# EAGLE design untitled (EAGLE 5.09)
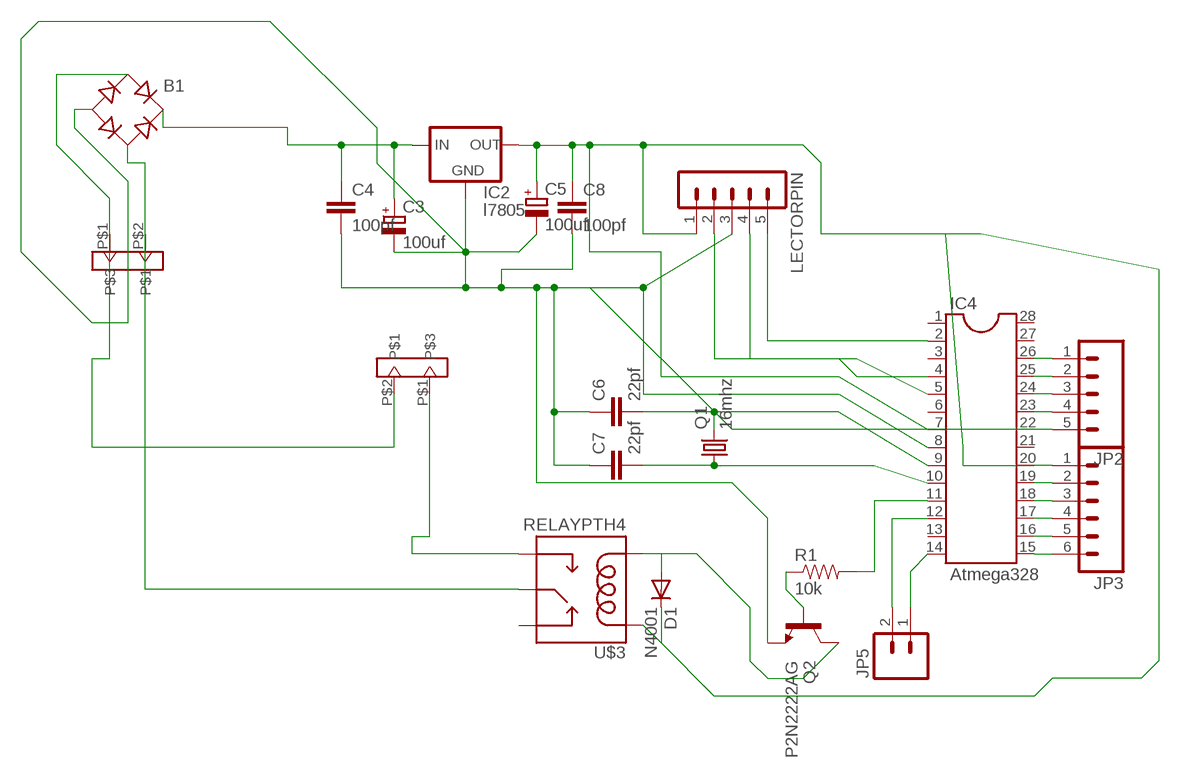
[diagram p0: schematic, sheet 1]

## Parts
B1  RB1A  [RB1A]
C3  100uf  CPOL-EUE5-4  [E5-4]
C4  100pf  C-EU025-025X050  [C025-025X050]
C5  100uf  CPOL-EUE5-4  [E5-4]
C6  22pf  C-EU025-025X050  [C025-025X050]
C7  22pf  C-EU025-025X050  [C025-025X050]
C8  100pf  C-EU025-025X050  [C025-025X050]
D1  N4001  DIODEPTH  [DIODE-1N4001]
IC2  l7805  V_REG_78XXSIDE  [78XXL]
IC4  Atmega328  DIL28-3  [DIL28-3]
JP2  M05PTH_LONGPADS  [1X05_LONGPADS]
JP3  M06LONGPADS  [1X06_LONGPADS]
JP5  M02LOCK_LONGPADS  [1X02_LOCK_LONGPADS]
LECTORPIN  MA05-1  [MA05-1]
Q1  16mhz  CRYSTALHC49U70  [HC49U70]
Q2  P2N2222AG  TRANSISTOR_NPNTO92  [TO-92]
R1  10k  RESISTORAXIAL-0.3  [AXIAL-0.3]
U$3  RELAYPTH4  [RELAY-JZC]
U$4  WIRE  [WIRE]
U$5  WIRE  [WIRE]

## Nets
N$1: IC4.11 R1.P$2
N$2: D1.A Q2.3(C) U$3.1(COIL2)
N$4: C6.2 IC4.9 Q1.2
N$5: C7.2 IC4.10 Q1.1
N$6: IC4.16 JP3.5
N$7: B1.+ C3.+ C4.1 IC2.IN
N$8: U$3.3(NO) U$4.P$1
N$10: B1.AC1 U$4.P$2 U$5.P$1
N$13: IC4.23 JP2.4
N$15: IC4.4 LECTORPIN.4
N$16: IC4.2 LECTORPIN.5
N$17: IC4.17 JP3.4
N$20: IC4.18 JP3.3
N$21: IC4.19 JP3.2
N$22: IC4.24 JP2.3
N$29: IC4.5 LECTORPIN.2
N$30: IC4.15 JP3.6
N$31: Q2.2(B) R1.P$1
N$32: B1.- C3.- C4.2 C5.- C6.1 C7.1 C8.2 IC2.GND IC4.8 IC4.22 JP2.5 LECTORPIN.3 Q2.1(E)
N$33: C5.+ C8.1 D1.C IC2.OUT IC4.7 IC4.20 JP3.1 LECTORPIN.1 U$3.5(COIL1)
N$34: IC4.25 JP2.2
N$35: IC4.26 JP2.1
N$36: IC4.12 JP5.2
N$37: IC4.14 JP5.1
N$41: B1.AC2 U$3.4(MAIN) U$5.P$2
Unconnected: IC4.1 IC4.3 IC4.6 IC4.13 IC4.21 IC4.27 IC4.28 U$3.2(NC)

## Library data of the parts
B1 = rectifier:RB1A: RECTIFIER 1 A
C3 C5 = resistor:CPOL-EU: POLARIZED CAPACITOR, European symbol
C4 C6-C8 = rcl:C-EU: CAPACITOR, European symbol
D1 = SparkFun:DIODE: Diode These are standard reverse protection diodes and small signal diodes. SMA package can handle up to about 1A. SOD-323 can handle about 200mA. What the SOD-323 package when ordering, there are some mfgs out there that are 5-pin packages.
IC2 = SparkFun:V_REG_78XX: Voltage Regulator Standard 7805 5V regulator. IGO (Input Ground Output). Spark Fun Electronics SKU : COM-00107
IC4 = ic-package:DIL28: Dual In Line
JP2 = SparkFun:M05: Header 5 Standard 5-pin 0.1" header. Use with straight break away headers (SKU : PRT-00116), right angle break away headers (PRT-00553), swiss pins (PRT-00743), machine pins (PRT-00117), and female headers (PRT-00115). Molex polarized connector foot print use with SKU : PRT-08230 with associated crimp pins and housings.
JP3 = SparkFun:M06: Header 6 Standard 6-pin 0.1" header. Use with straight break away headers (SKU : PRT-00116), right angle break away headers (PRT-00553), swiss pins (PRT-00743), machine pins (PRT-00117), and female headers (PRT-00115). Molex polarized connector foot print use with SKU : PRT-08094 with associated crimp pins and housings. NOTES ON THE VARIANTS LOCK and LOCK_LONGPADS... This footprint was designed to help hold the alignment of a through-hole component (i.e. 6-pin header) while soldering it into place. You may notice that each hole has been shifted either up or down by 0.005 of an inch from it's more standard position (which is a perfectly straight line). This slight alteration caused the pins (the squares in the middle) to touch the edges of the holes. Because they are alternating, it causes a "brace" to hold the component in place. 0.005 has proven to be the perfect amount of "off-center" position when using our standard breakaway headers. Although looks a little odd when you look at the bare footprint, once you have a header in there, the alteration is very hard to notice. Also, if you push a header all the way into place, it is covered up entirely on the bottom side. This idea of altering the position of holes to aid alignment will be further integrated into the Sparkfun Library for other footprints. It can help hold any component with 3 or more connection pins.
JP5 = SparkFun:M02: Header 2 Standard 2-pin 0.1" header. Use with straight break away headers (SKU : PRT-00116), right angle break away headers (PRT-00553), swiss pins (PRT-00743), machine pins (PRT-00117), and female headers (PRT-00115). Molex polarized connector foot print use with SKU : PRT-08233 with associated crimp pins and housings.
LECTORPIN = con-lstb:MA05-1: PIN HEADER
Q1 = crystal:CRYSTAL: CRYSTAL
Q2 = SparkFun:TRANSISTOR_NPN: Transistor NPN BJT configuration in SOT23 package. MMBT2222 is the common NPN we use. Double check BCE configuration again layout.
R1 = SparkFun:RESISTOR: Resistor Basic schematic elements and footprints for 0603, 1206, and PTH resistors.
U$3 = SparkFun:RELAY
U$4 U$5 = boton:WIRE

## Board
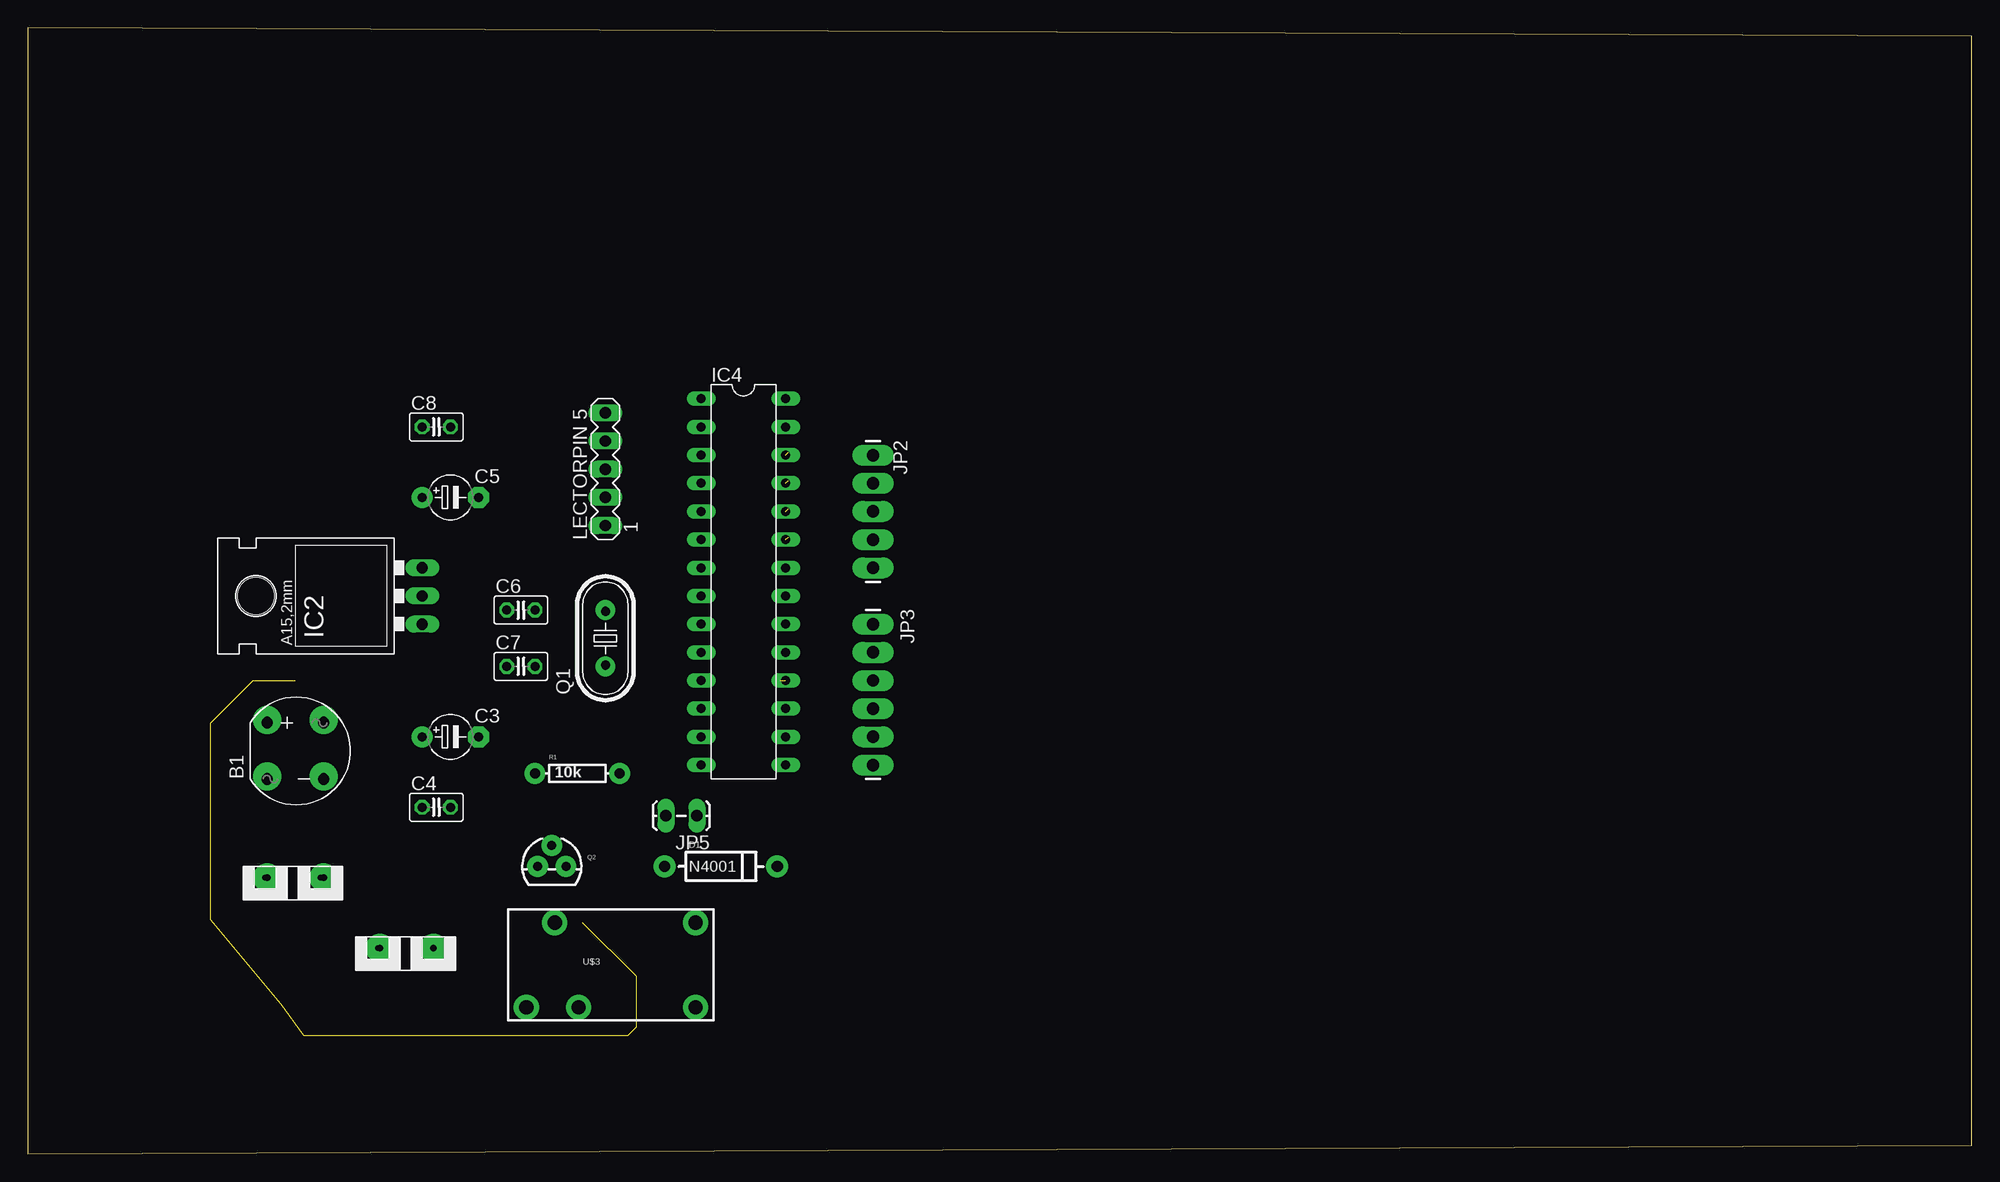
[diagram p1: board, top side]
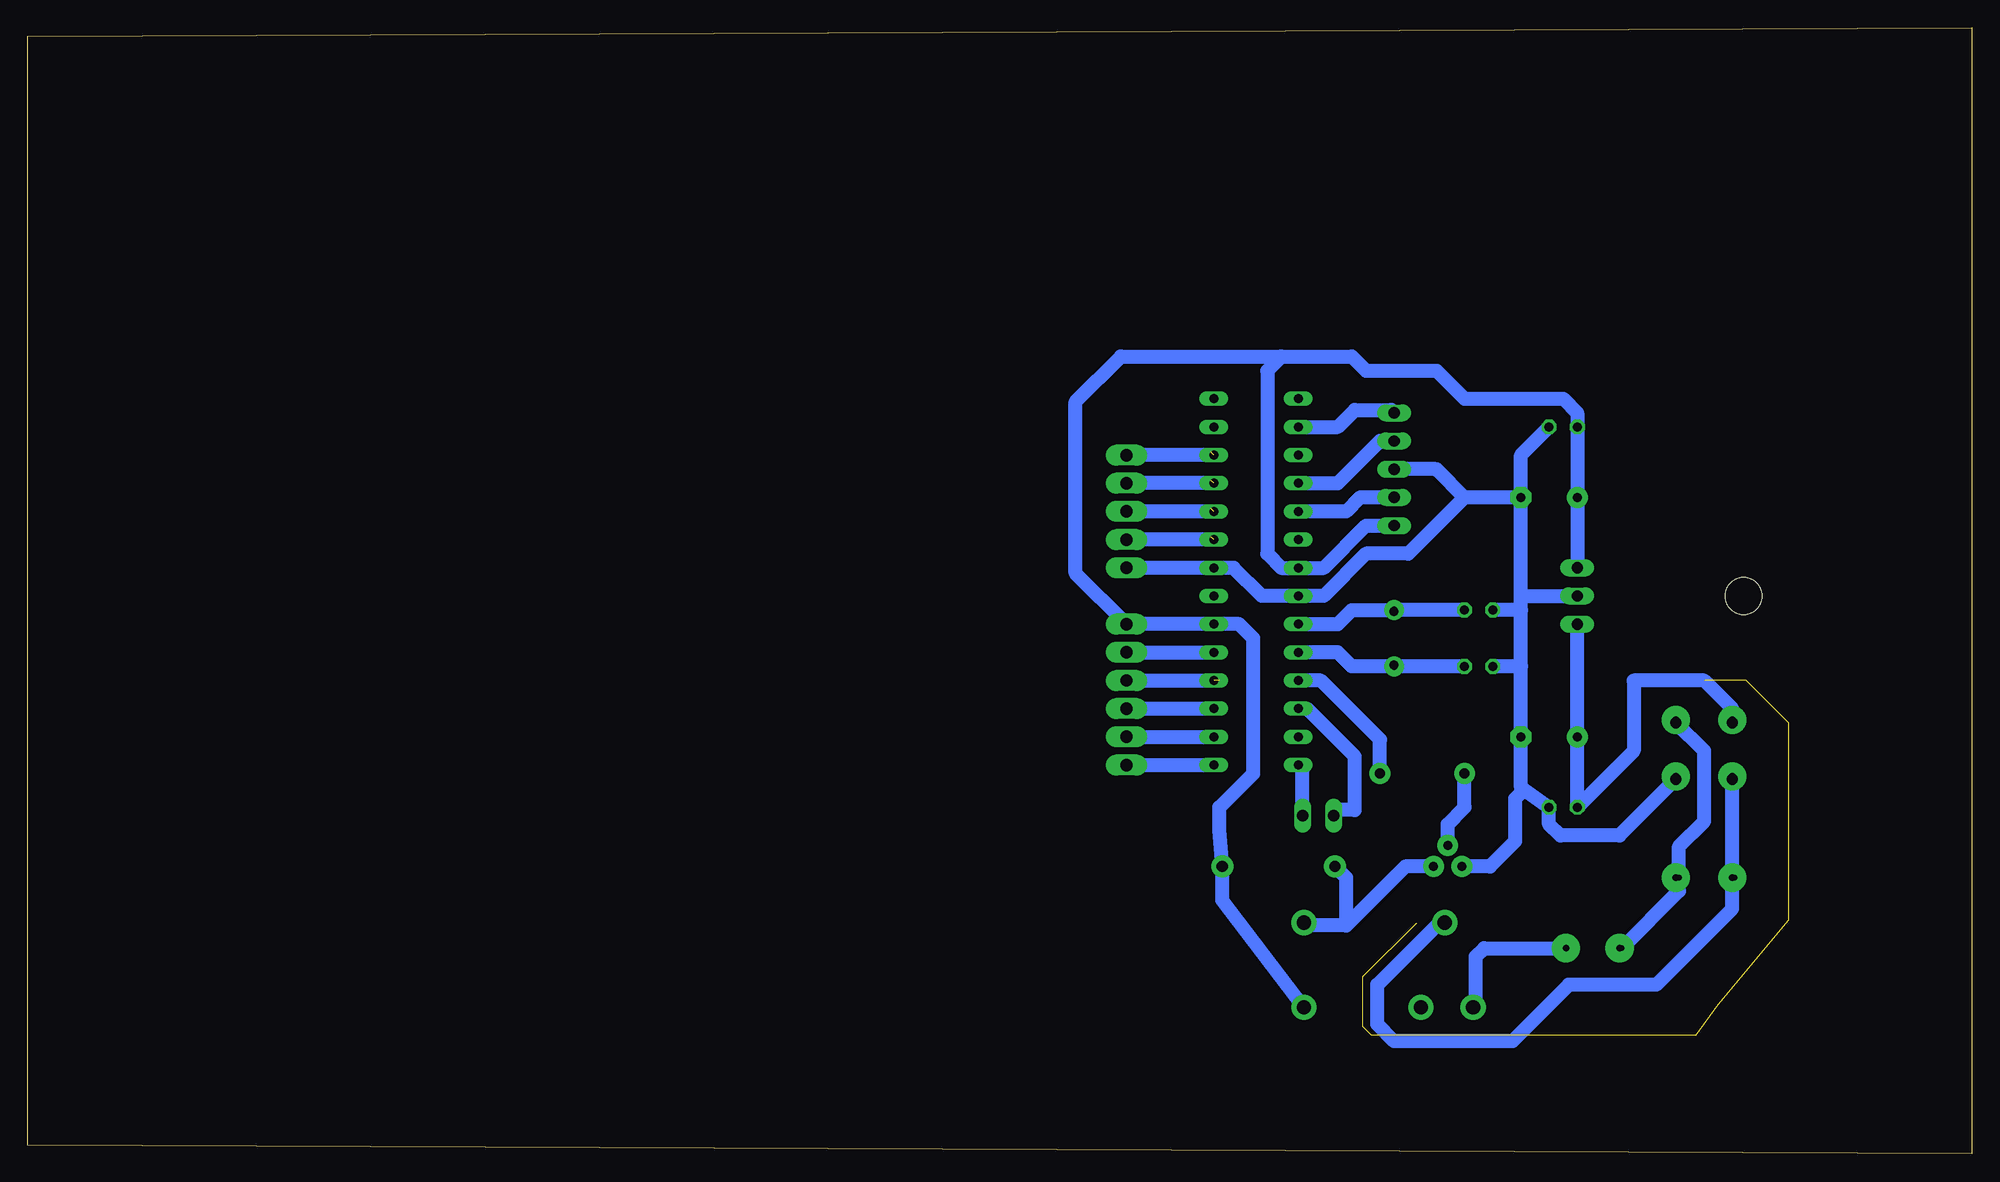
[diagram p2: board, bottom side, seen from below]

Size 175.24 x 101.52 mm. Coordinates in mm from the lower left corner, seen from the top.
Outline: 0,0 175.24,0.76 175.24,100.76 0,101.52 0,0
Copper layers (1*16): Top 0.035mm / dielectric 1.5mm / Bottom 0.035mm
Design rules "default": minimum track width 10mil, minimum drill 24mil, track to track 8mil, track to pad 8mil, pad to pad 8mil, via to via 8mil, smd to smd 8mil, copper to edge 40mil, drill to drill 8mil, minimum pad ring 10mil, minimum via ring 8mil, stop-mask expansion 4mil, vias tented up to drill 0mil, thermal gap 10mil

### Footprints (pad centres in the part's own frame; a part is rotated, then mirrored left to right if it is on the bottom)
RB1A = drill 1.016 round: + -2.54,2.54 | drill 1.016 octagon: - 2.54,-2.54; AC1 2.54,2.54; AC2 -2.54,-2.54
E5-4 = drill 0.813 pad 1.905 round: + -2.54,0 | drill 0.813 pad 1.905 octagon: - 2.54,0
C025-025X050 = drill 0.813 octagon: 1 -1.27,0; 2 1.27,0
DIODE-1N4001 = drill 1 pad 1.981 round: A -5.08,0; C 5.08,0
78XXL = drill 1.016 long: GND 0,-3.81; IN -2.54,-3.81; OUT 2.54,-3.81 | hole 3.302: 0,11.176
DIL28-3 = drill 0.813 long: 1 -16.51,-3.81; 2 -13.97,-3.81; 3 -11.43,-3.81; 4 -8.89,-3.81; 5 -6.35,-3.81; 6 -3.81,-3.81; 7 -1.27,-3.81; 8 1.27,-3.81; 9 3.81,-3.81; 10 6.35,-3.81; 11 8.89,-3.81; 12 11.43,-3.81; 13 13.97,-3.81; 14 16.51,-3.81; 15 16.51,3.81; 16 13.97,3.81; 17 11.43,3.81; 18 8.89,3.81; 19 6.35,3.81; 20 3.81,3.81; 21 1.27,3.81; 22 -1.27,3.81; 23 -3.81,3.81; 24 -6.35,3.81; 25 -8.89,3.81; 26 -11.43,3.81; 27 -13.97,3.81; 28 -16.51,3.81
1X05_LONGPADS = drill 1.118 pad 1.88 long: 1 0,0; 2 2.54,0; 3 5.08,0; 4 7.62,0; 5 10.16,0
1X06_LONGPADS = drill 1.118 pad 1.88 long: 1 0,0; 2 2.54,0; 3 5.08,0; 4 7.62,0; 5 10.16,0; 6 12.7,0
1X02_LOCK_LONGPADS = drill 1.016 long: 1 -0.127,0; 2 2.667,0
MA05-1 = drill 1.016 long: 1 -5.08,0; 2 -2.54,0; 3 0,0; 4 2.54,0; 5 5.08,0
HC49U70 = drill 0.813 round: 1 -2.413,0; 2 2.413,0
TO-92 = drill 0.813 pad 1.88 round: 1 -1.27,0; 2 0,1.905; 3 1.27,0
AXIAL-0.3 = drill 0.9 pad 1.88 round: P$1 -3.81,0; P$2 3.81,0
RELAY-JZC = drill 1.3 pad 2.286 round: 1 3.81,-8.89; 2 -3.81,1.651; 3 -3.81,6.35; 4 3.81,3.81; 5 -3.81,-8.89
WIRE = drill 0.5 pad 1.27 round: P$1 -1,0; P$2 4,0

### Placement (x,y rotation side)
B1  24.13,36.32 0 top
C3  38.1,37.59 0 top
C4  36.83,31.24 0 top
C5  38.1,59.18 0 top
C6  44.45,49.02 0 top
C7  44.45,43.94 0 top
C8  36.83,65.53 0 top
D1  62.48,25.91 0 top
IC2  31.75,50.29 90 top
IC4  64.52,51.56 270 top
JP2  76.2,62.99 270 top
JP3  76.2,47.75 270 top
JP5  60.2,30.48 180 top
LECTORPIN  52.07,61.72 90 top
Q1  52.07,46.48 90 top
Q2  47.24,25.91 0 top
R1  49.53,34.29 0 top
U$3  51.31,17.02 90 top
U$4  35.56,18.54 180 top
U$5  25.4,24.89 180 top

### Tracks (layer width: path | path; a pad name or v marks a point on that pad's centre or on a via)
N$1
  Bottom 1.27: IC4.11 58.67,42.67 53.34,37.34 R1.P$2
N$2
  Bottom 1.27: Q2.3 51.05,25.91 56.39,20.57 | 56.39,20.57 59.94,20.57 U$3.1 | 56.39,20.57 56.39,24.89 D1.A
N$4  (via drill 0.6 pad 1.78)
  Bottom 1.27: C6.2 v52.07,49.02 52.2,49.02 | IC4.9 57.15,47.75 55.88,49.02 52.2,49.02 | 52.2,49.02 Q1.2
N$5  (via drill 0.6 pad 1.78)
  Bottom 1.27: C7.2 51.94,43.94 Q1.1 v52.07,43.94 55.88,43.94 57.15,45.21 IC4.10
N$6
  Bottom 1.27: JP3.5 IC4.16
N$7  (via drill 0.6 pad 2.54)  (10 unrouted)
  Bottom 1.27: IC2.IN C3.+ C4.1 30.48,36.32 30.48,42.67 24.13,42.67 21.59,40.13 v21.59,39.12 B1.+
N$8  (via drill 0.6 pad 2.54)
  Bottom 1.27: U$4.P$1 v36.58,18.54 43.94,18.54 44.7,17.78 44.7,13.46 U$3.3
N$10
  Bottom 1.27: B1.AC1 24.13,36.32 24.13,29.97 26.4,27.7 U$5.P$1 26.4,23.7 U$4.P$2
N$13  (1 unrouted)
  Bottom 1.27: IC4.23 JP2.4
N$15
  Bottom 1.27: IC4.4 57.15,60.45 53.34,64.26 LECTORPIN.4
N$16
  Bottom 1.27: IC4.2 57.15,65.53 55.63,67.06 52.32,67.06 LECTORPIN.5
N$17
  Bottom 1.27: JP3.4 IC4.17
N$19  (via drill 0.6 pad 2.54)
  other vias: 26.67,24.89
N$20  (1 unrouted)
  Bottom 1.27: JP3.3 67.82,42.67
N$21
  Bottom 1.27: JP3.2 IC4.19
N$22  (1 unrouted)
  Bottom 1.27: IC4.24 JP2.3
N$23  (via drill 0.6 pad 2.54)
  other vias: 31.75,18.54
N$29
  Bottom 1.27: LECTORPIN.2 55.01,59.18 arc-45 55.19,59.11 56.39,57.91 IC4.5
N$30
  Bottom 1.27: JP3.6 IC4.15
N$31
  Bottom 1.27: R1.P$1 45.72,31.24 47.24,29.72 Q2.2
N$32
  Bottom 1.27: 40.35,32.82 C4.2 38.1,29.72 37.08,28.7 31.75,28.7 B1.- | 40.35,32.82 40.64,33.02 C3.- 40.64,43.94 | 40.64,43.94 40.64,49.02 | 40.64,49.02 40.64,50.29 | 40.64,50.29 C5.- | C5.- 40.64,62.99 C8.2 | 40.64,49.02 C6.1 | 40.64,50.29 IC2.GND | 40.64,43.94 C7.1 | C5.- 45.72,59.18 | 45.72,59.18 50.8,54.1 54.61,54.1 58.42,50.29 IC4.8 64.01,50.29 66.55,52.83 IC4.22 JP2.5 | LECTORPIN.3 48.37,61.72 arc45 48.19,61.65 45.72,59.18 | Q2.1 43.43,25.91 41.15,28.19 41.15,32.02 40.35,32.82
N$33
  Bottom 1.27: IC2.OUT C5.+ C8.1 35.56,66.8 36.83,68.07 45.72,68.07 48.26,70.61 54.61,70.61 55.88,71.88 62.23,71.88 | 62.23,71.88 63.5,70.61 63.5,54.1 62.23,52.83 IC4.7 58.42,52.83 54.61,56.64 LECTORPIN.1 | U$3.5 67.56,22.86 D1.C 67.82,29.21 67.82,31.24 64.77,34.29 64.77,46.48 66.04,47.75 IC4.20 JP3.1 80.77,52.32 80.77,67.82 76.71,71.88 62.23,71.88
N$34  (1 unrouted)
  Bottom 1.27: IC4.25 JP2.2
N$35  (1 unrouted)
  Bottom 1.27: IC4.26 JP2.1
N$36
  Bottom 1.27: IC4.12 59.94,40.13 55.63,35.81 55.63,30.99 57.02,30.99 JP5.2
N$37
  Bottom 1.27: JP5.1 60.33,34.67 IC4.14
N$38  (via drill 0.6 pad 2.54)
  other vias: 26.67,39.12
N$39  (via drill 0.6 pad 2.54)
  other vias: 21.59,34.04
N$40  (via drill 0.6 pad 2.54)
  other vias: 26.67,34.04
N$41  (via drill 0.6 pad 2.54)
  Bottom 1.27: v21.59,24.89 U$5.P$2 | v21.59,24.89 B1.AC2 | U$3.4 48.01,20.83 53.59,15.24 53.59,11.68 52.07,10.16 41.4,10.16 36.32,15.24 28.45,15.24 21.59,22.1 v21.59,24.89